# EAGLE design Raspi_Photometer_v2 (EAGLE 7.3.0)
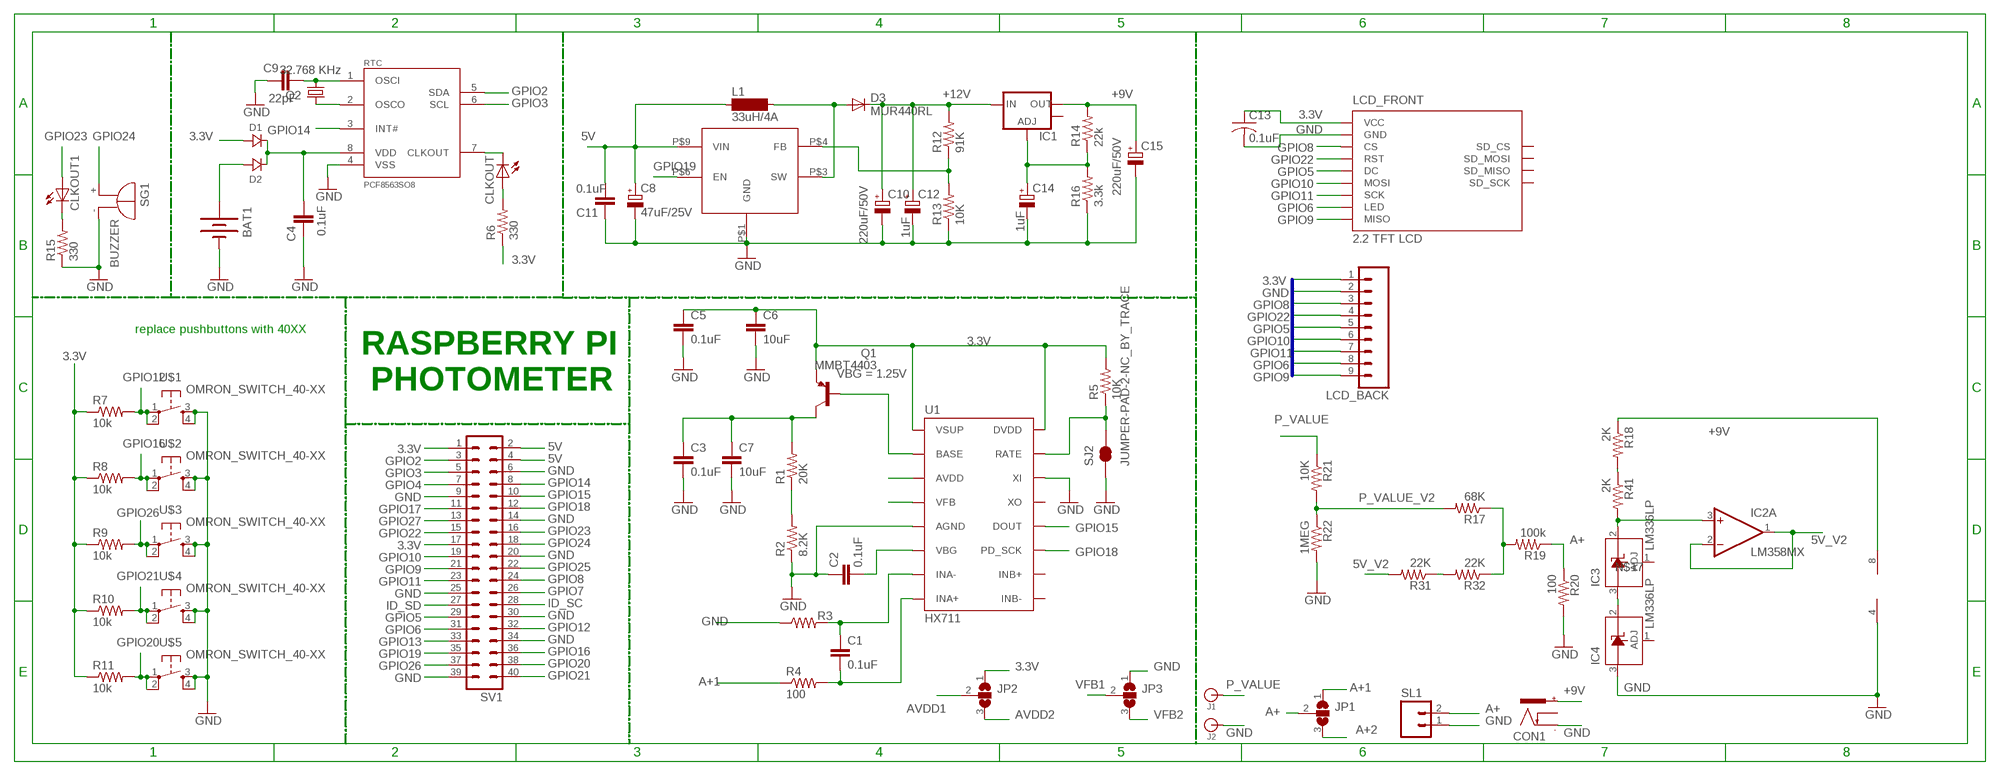
[diagram p0: schematic, sheet 1]

## Parts
BAT1  BATTERY20PTH  [BATTCOM_20MM_PTH]
C1  0.1uF  0.1UF-25V-5%(0603)  [0603-CAP]
C2  0.1uF  0.1UF-25V-5%(0603)  [0603-CAP]
C3  0.1uF  0.1UF-25V-5%(0603)  [0603-CAP]
C4  0.1uF  C-EUC0805K  [C0805K]
C5  0.1uF  0.1UF-25V-5%(0603)  [0603-CAP]
C6  10uF  10UF50V20%(1210)  [1210]
C7  10uF  10UF50V20%(1210)  [1210]
C8  47uF/25V  CPOL-EUE3.5-10  [E3,5-10]
C9  22pF  C-EUC0805K  [C0805K]
C10  220uF/50V  CPOL-EUE5-10.5  [E5-10,5]
C11  0.1uF  C-EUC0603  [C0603]
C12  1uF  CPOL-EUE2.5-5  [E2,5-5]
C13  0.1uF  C-USC0805  [C0805]
C14  1uF  CPOL-EUE2.5-5  [E2,5-5]
C15  220uF/50V  CPOL-EUE5-10.5  [E5-10,5]
CLKOUT  LED0805  [CHIPLED_0805]
CLKOUT1  LED1206  [CHIPLED_1206]
CON1  POWER_CON  [NEB21R]
D1  SS14  [DO214]
D2  SS14  [DO214]
D3  MUR440RL  [C2673]
IC1  V_REG_LM1117SOT223  [SOT223]
IC2  LM358MX  [SO08]
IC3  LM336LP  [TO92]
IC4  LM336LP  [TO92]
J1  BANANA_CONN  [BANANA_CONN]
J2  BANANA_CONN  [BANANA_CONN]
JP1  SJ2W  [SJ_2]
JP2  SJ2W  [SJ_2]
JP3  SJ2W  [SJ_2]
L1  33uH/4A  MS85  [MS85]
LCD_BACK  M09  [09P]
LCD_FRONT  TFT_LCD_2.2  [TFT_LCD_2.2]
Q1  MMBT4403  2N4403-PNP-TO92-EBC  [TO92-EBC]
Q2  32.768 KHz  CRYSTALTC26H  [TC26H]
R1  20K  R-US_0204/7  [0204/7]
R2  8.2K  R-US_0204/7  [0204/7]
R3  100  R-US_0207/15  [0207/15]
R4  100  R-US_0207/7  [0207/7]
R5  10K  R-US_0207/7  [0207/7]
R6  330  R-US_0204/7  [0204/7]
R7  10k  R-US_0204/7  [0204/7]
R8  10k  R-US_0204/7  [0204/7]
R9  10k  R-US_0204/7  [0204/7]
R10  10k  R-US_0204/7  [0204/7]
R11  10k  R-US_0204/7  [0204/7]
R12  91K  RESISTOR0207/7  [0207/7]
R13  10K  RESISTOR0207/7  [0207/7]
R14  22k  RESISTOR0207/7  [0207/7]
R15  330  R-US_0204/7  [0204/7]
R16  3.3k  RESISTOR0207/7  [0207/7]
R17  68K  RESISTOR0207/7  [0207/7]
R18  2K  RESISTOR0207/7  [0207/7]
R19  100k  RESISTOR0207/7  [0207/7]
R20  100  RESISTOR0207/7  [0207/7]
R21  10K  RESISTOR0207/7  [0207/7]
R22  1MEG  RESISTOR0207/7  [0207/7]
R31  22K  RESISTOR0207/7  [0207/7]
R32  22K  RESISTOR0207/7  [0207/7]
R41  2K  RESISTOR0207/7  [0207/7]
RTC  PCF8563SO8  [SOIC8]
SG1  BUZZER  [F/TMB]
SJ2  JUMPER-PAD-2-NC_BY_TRACE  [PAD-JUMPER-2-NC_BY_TRACE_YES_SILK]
SL1  M02  [02P]
SV1  ML40  [ML40]
U1  HX711  HX711HX711  [SO16]
U$1  OMRON_SWITCH_40-XX  [B3F-40XX]
U$2  OMRON_SWITCH_40-XX  [B3F-40XX]
U$3  OMRON_SWITCH_40-XX  [B3F-40XX]
U$4  OMRON_SWITCH_40-XX  [B3F-40XX]
U$5  OMRON_SWITCH_40-XX  [B3F-40XX]
U$6  XL6009  [TO-263-5L]

## Nets
3.3V: C5.1 C6.1 C13.1 D1.ANODE JP2.1 LCD_BACK.1 LCD_FRONT.VCC Q1.E R5.2 R6.1 R7.1 R8.1 R9.1 R10.1 R11.1 SV1.1 SV1.17 U1.1(VSUP) U1.16(DVDD)
5V: C8.+ C11.2 L1.1 SV1.2 SV1.4 U$6.P$9(VIN)
5V_V2: IC2.1(A:OUT) IC2.2(A:-IN) R31.2
+9V: C15.+ CON1.+ IC1.2(OUT) IC2.8(P:V+) R14.2 R18.1
+12V: C10.+ C12.+ D3.C IC1.3(IN) R12.2
A+: JP1.2 R19.1 R20.1 SL1.2
A+1: JP1.1 R4.1
A+2: JP1.3
AVDD1: JP2.2 U1.3(AVDD)
AVDD2: C3.1 C7.1 JP2.3 Q1.C R1.2
GND: BAT1.2(-) C2.1 C3.2 C4.1 C5.2 C6.2 C7.2 C8.- C9.1 C10.- C11.1 C12.- C13.2 C14.- C15.- CON1.- IC2.4(P:V-) IC4.3(A) J2.P$2 JP3.1 LCD_BACK.2 LCD_FRONT.GND R2.1 R3.1 R13.1 R15.1 R16.1 R20.2 R22.2 RTC.4(VSS) SG1.- SJ2.1 SL1.1 SV1.6 SV1.9 SV1.14 SV1.20 SV1.25 SV1.30 SV1.34 SV1.39 U1.5(AGND) U1.14(XI) U$1.3(S) U$1.4(S1) U$2.3(S) U$2.4(S1) U$3.3(S) U$3.4(S1) U$4.3(S) U$4.4(S1) U$5.3(S) U$5.4(S1) U$6.P$1(GND)
GPIO2: RTC.5(SDA) SV1.3
GPIO3: RTC.6(SCL) SV1.5
GPIO4: SV1.7
GPIO5: LCD_BACK.5 LCD_FRONT.DC SV1.29
GPIO6: LCD_BACK.8 LCD_FRONT.LED SV1.31
GPIO7: SV1.26
GPIO8: LCD_BACK.3 LCD_FRONT.CS SV1.24
GPIO9: LCD_BACK.9 LCD_FRONT.MISO SV1.21
GPIO10: LCD_BACK.6 LCD_FRONT.MOSI SV1.19
GPIO11: LCD_BACK.7 LCD_FRONT.SCK SV1.23
GPIO12: R7.2 SV1.32 U$1.1(P) U$1.2(P1)
GPIO13: SV1.33
GPIO14: RTC.3(INT#) SV1.8
GPIO15: SV1.10 U1.12(DOUT)
GPIO16: R8.2 SV1.36 U$2.1(P) U$2.2(P1)
GPIO17: SV1.11
GPIO18: SV1.12 U1.11(PD_SCK)
GPIO19: SV1.35 U$6.P$6(EN)
GPIO20: R11.2 SV1.38 U$5.1(P) U$5.2(P1)
GPIO21: R10.2 SV1.40 U$4.1(P) U$4.2(P1)
GPIO22: LCD_BACK.4 LCD_FRONT.RST SV1.15
GPIO23: CLKOUT1.A SV1.16
GPIO24: SG1.+ SV1.18
GPIO25: SV1.22
GPIO26: R9.2 SV1.37 U$3.1(P) U$3.2(P1)
GPIO27: SV1.13
ID_SC: SV1.28
ID_SD: SV1.27
N$1: R5.1 SJ2.2 U1.15(RATE)
N$2: C1.1 R3.2 U1.7(INA-)
N$3: C1.2 R4.2 U1.8(INA+)
N$4: Q1.B U1.2(BASE)
N$5: BAT1.1(+) D2.ANODE
N$6: R31.1 R32.2
N$7: C2.2 U1.6(VBG)
N$8: C4.2 D1.CATHODE D2.CATHODE RTC.8(VDD)
N$9: CLKOUT.C RTC.7(CLKOUT)
N$10: CLKOUT.A R6.2
N$11: C9.2 Q2.1 RTC.1(OSCI)
N$12: Q2.2 RTC.2(OSCO)
N$14: D3.A L1.2 U$6.P$3(SW)
N$16: R12.1 R13.2 U$6.P$4(FB)
N$17: IC2.3(A:+IN) IC3.2(C) R41.2
N$18: C14.+ IC1.1(ADJ) R14.1 R16.2
N$19: CLKOUT1.C R15.2
N$20: R17.1 R19.2 R32.1
N$21: R18.2 R41.1
N$22: IC3.3(A) IC4.2(C)
P_VALUE: J1.P$2 R21.1
P_VALUE_V2: R17.2 R21.2 R22.1
VFB1: JP3.2 U1.4(VFB)
VFB2: JP3.3 R1.1 R2.2
Unconnected: CON1.C IC1.4(OUT) IC2.5(B:+IN) IC2.6(B:-IN) IC2.7(B:OUT) IC3.1(ADJ) IC4.1(ADJ) LCD_FRONT.SD_CS LCD_FRONT.SD_MISO LCD_FRONT.SD_MOSI LCD_FRONT.SD_SCK U1.9(INB-) U1.10(INB+) U1.13(XO)

## Buses
3.3V,GND,GPIO8,GPIO22,GPIO5,GPIO10,GPIO11,GPIO6,GPIO9

## Notes on the sheet
- replace pushbuttons with 40XX
- VBG = 1.25V
- RASPBERRY PI 
   PHOTOMETER

## Library data of the parts
BAT1 = SparkFun-Electromechanical:BATTERY: Battery Holders Various common sizes : AA, AAA, 20mm coin cell and 12mm coin cell. 20MM_4LEGS, BATT-10373
C1-C3 C5 = SparkFun-Capacitors:0.1UF-25V-5%(0603): CAP-08604; PROD_ID: CAP-08604
C4 C9 C11 = rcl:C-EU: CAPACITOR, European symbol
C6 C7 = SparkFun-Capacitors:10UF50V20%(1210): CAP-09824; PROD_ID: CAP-09824
C8 C10 C15 = rcl:CPOL-EU: POLARIZED CAPACITOR, European symbol
C12 C14 = rcl (2):CPOL-EU: POLARIZED CAPACITOR, European symbol
C13 = rcl:C-US: CAPACITOR, American symbol
CLKOUT CLKOUT1 = CEDT_2016_V1:LED
CON1 = CEDT_July_2014:POWER_CON: DC Power Connector
D1 D2 = ihpcb-diode:SS14
D3 = diode:MUR440RL: DIODE ultra-fast recovery rectifier, Vrrm = 40 V, 4 A
IC1 = SparkFun-PowerIC:V_REG_LM1117: Voltage Regulator LM1117 Standard adjustable voltage regulator but in SMD form. Spark Fun Electronics SKU : COM-00595; PROD_ID: VREG-08170
IC2 = CEDT_July_2014:LM358: OP AMP also LM158; LM258; LM2904 Source: http://cache.national.com/ds/LM/LM158.pdf
IC3 IC4 = linear:LM336: 2.5-V INTEGRATED REFERENCE CIRCUITS LM236 Source: http://focus.ti.com/lit/ds/symlink/lm336-2.5.pdf
J1 J2 = SparkFun-Connectors:BANANA_CONN: Through-hole banana jack
JP1-JP3 = jumper:SJ2W: SMD solder JUMPER
L1 = inductor-neosid:MS85: INDUCTOR SMD power inductor; OC_FARNELL: unknown; OC_NEWARK: unknown
LCD_BACK = con-amp-quick:M09: AMP QUICK CONNECTOR; OC_FARNELL: unknown; OC_NEWARK: unknown
LCD_FRONT = CEDT_JANUARY_2015_v4:TFT_LCD_2.2
Q1 = transistor-neu-to92:*-PNP-: PNP Transistror
Q2 = CEDT_JANUARY_2015_v5:CRYSTAL: Crystals Various standard crystals. Proven footprints. Spark Fun Electronics SKU : COM-00534
R1-R11 R15 = rcl:R-US_: RESISTOR, American symbol
R12-R14 R16-R22 R31 R32 R41 = CEDTv83 (2):RESISTOR
RTC = CEDT_SEPTEMBER_V2:PCF8563
SG1 = CEDT_JANUARY_2015_v5:BUZZER: BUZZER Source: Buerklin; OC_FARNELL: unknown; OC_NEWARK: unknown
SJ2 = SparkFun-Passives:JUMPER-PAD-2-NC_BY_TRACE
SL1 = CEDT_JANUARY_2015_v5:M02: AMP QUICK CONNECTOR
SV1 = con-ml:ML40: HARTING; OC_FARNELL: unknown; OC_NEWARK: unknown
U1 = Testing:HX711; PROD_ID: IC-12445
U$1-U$5 = CEDT_JANUARY_2015_v5:OMRON_SWITCH
U$6 = XL6009:XL6009

## Net classes
1 pwr: width 0.457 mm

## Board
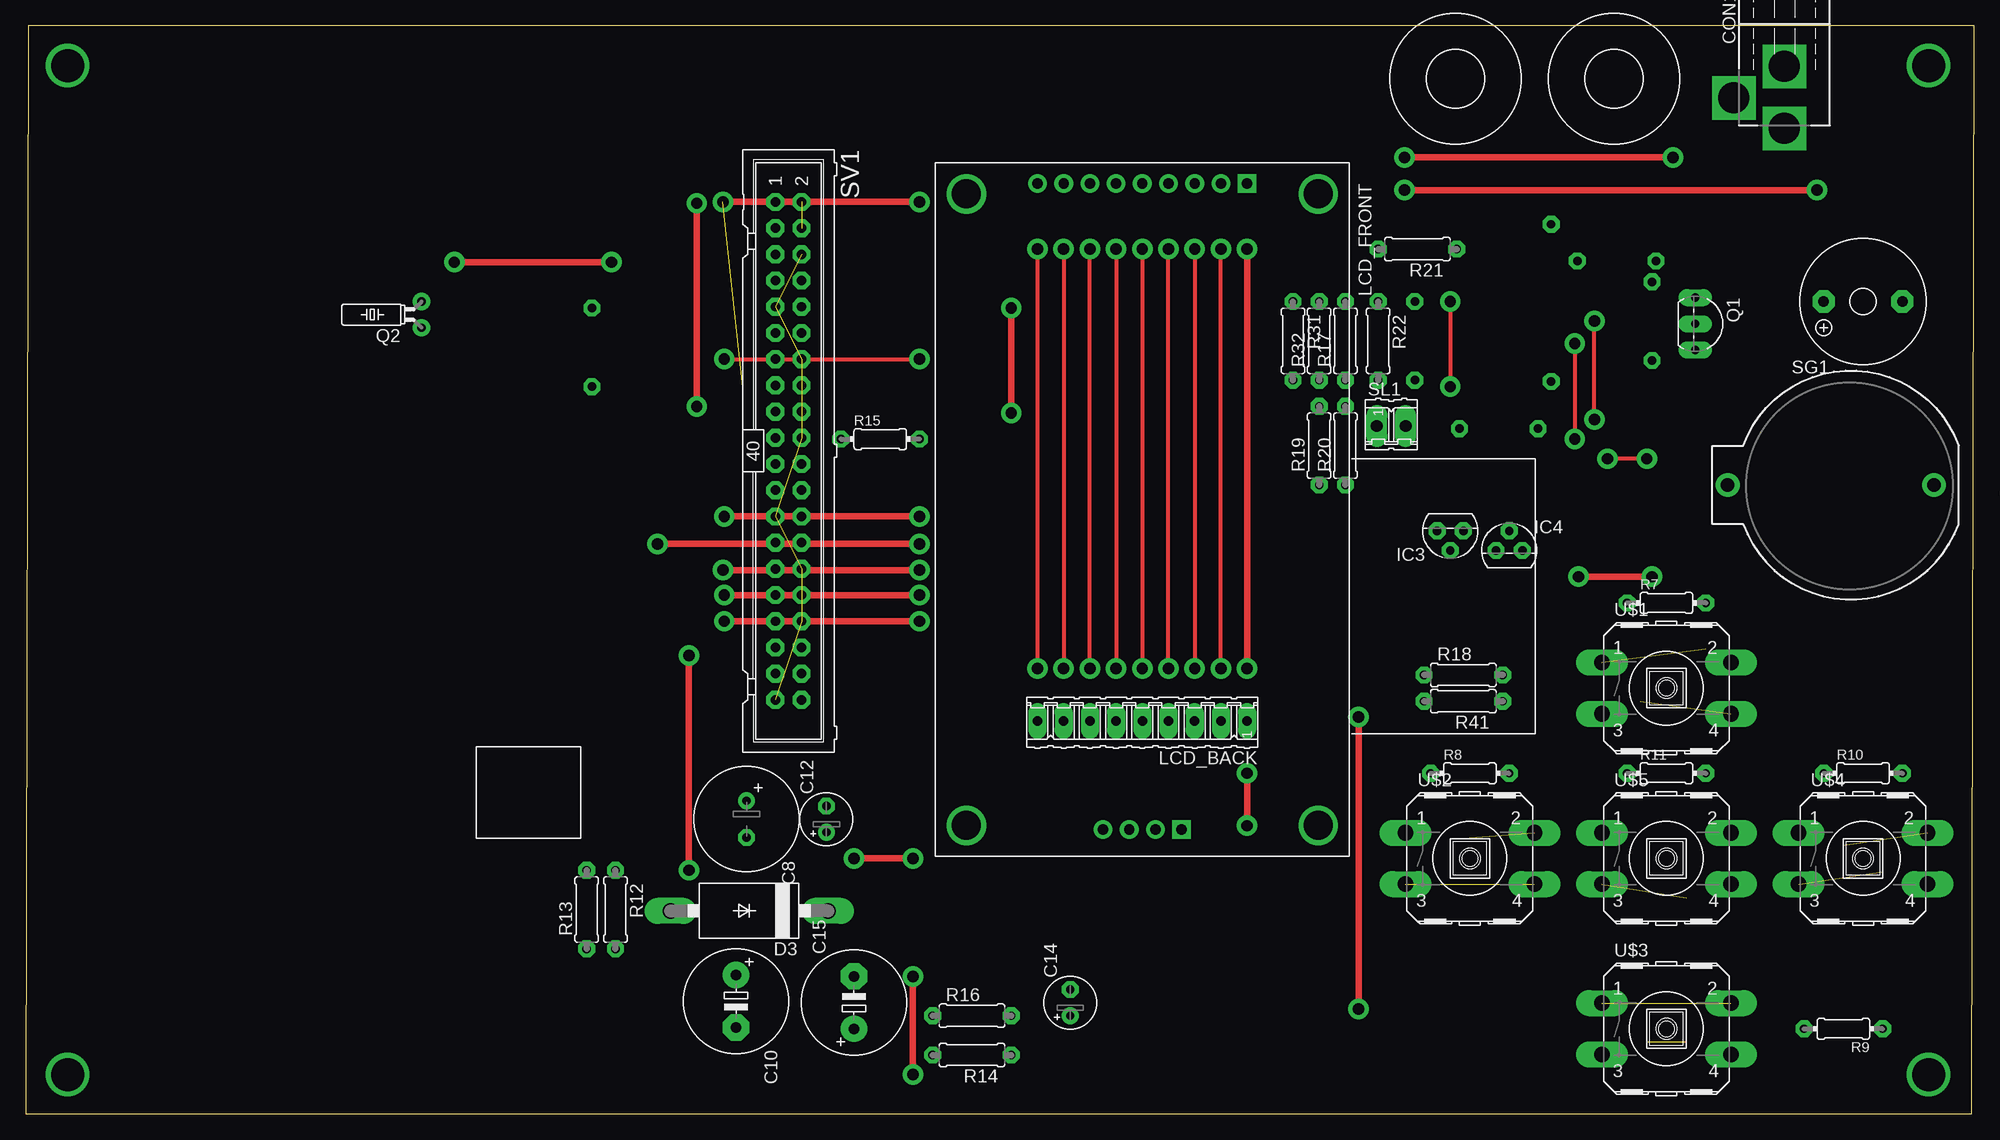
[diagram p1: board, top side]
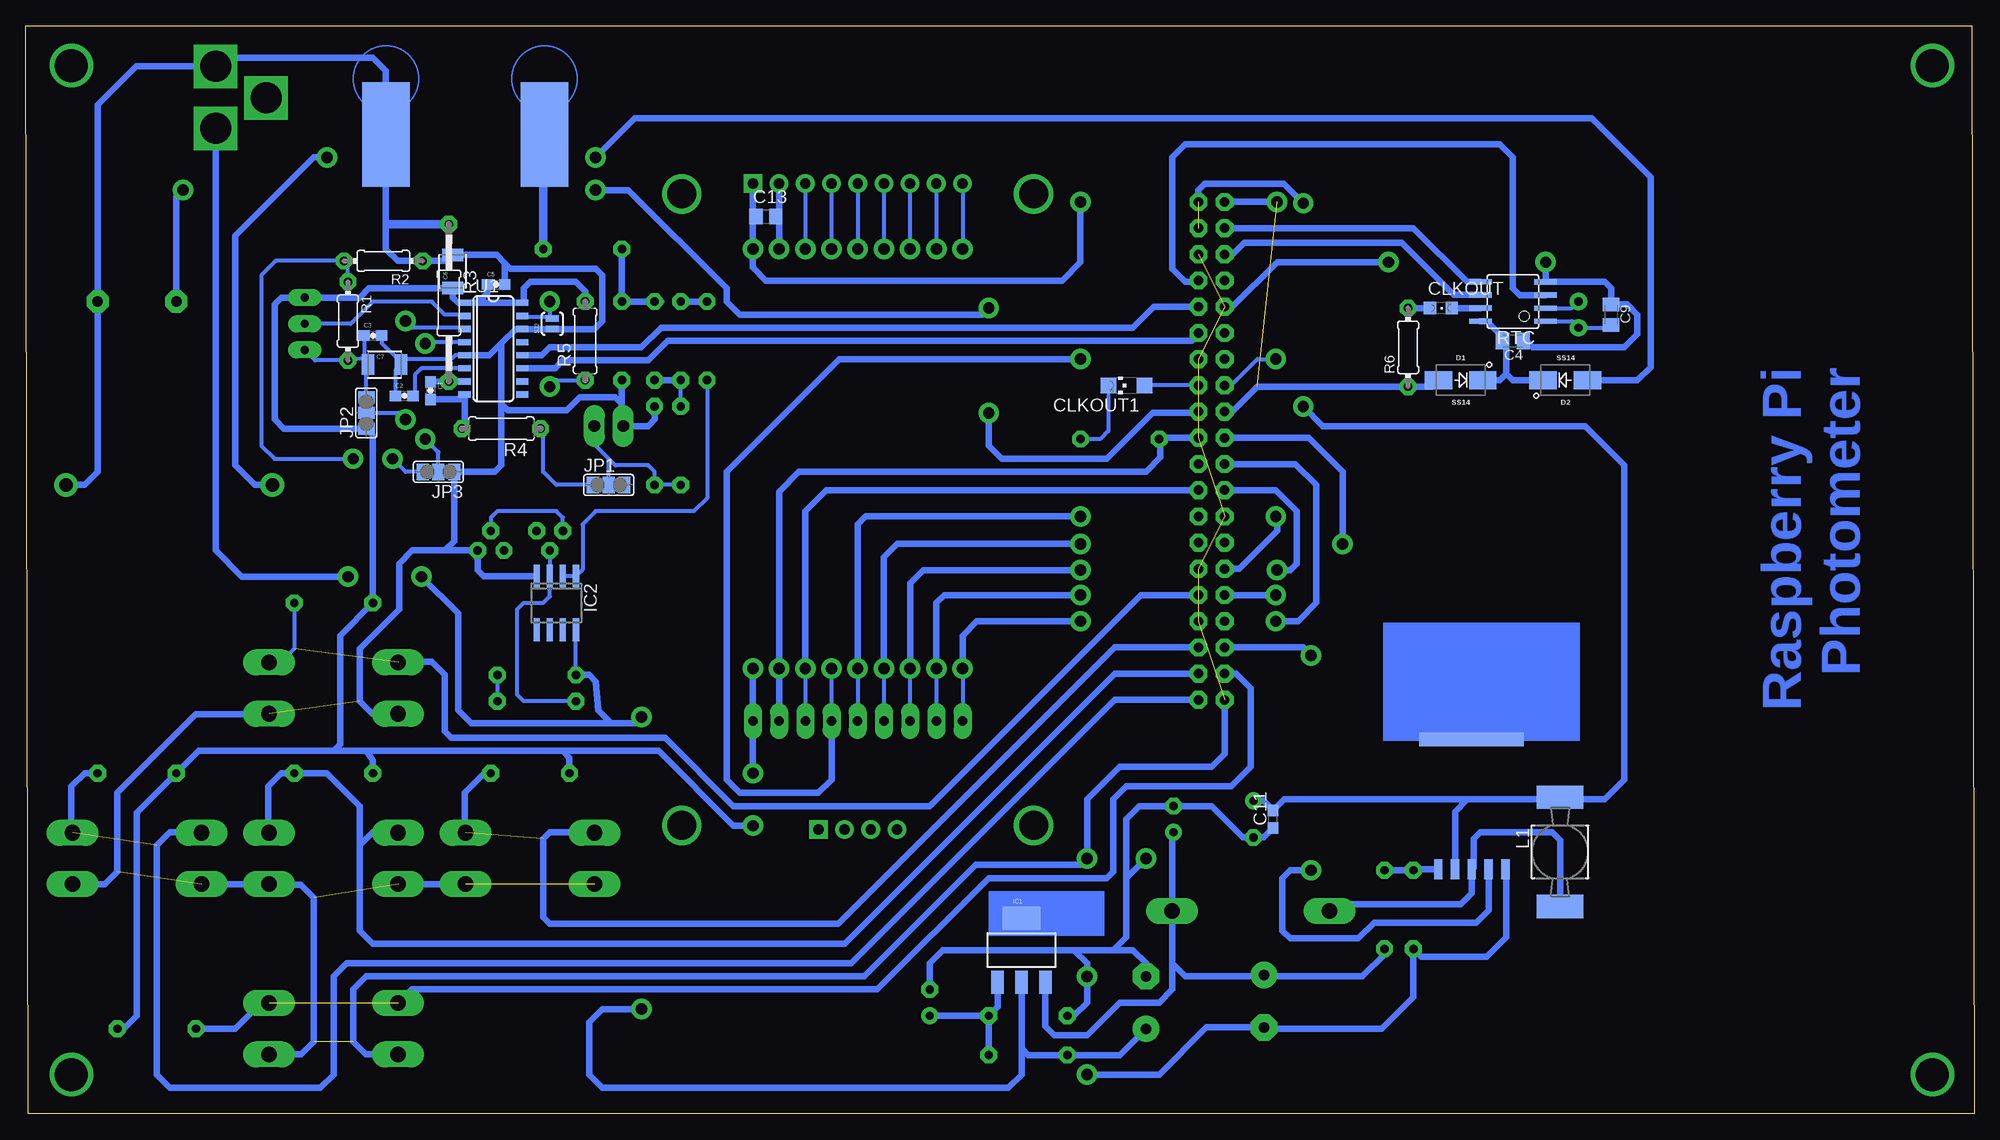
[diagram p2: board, bottom side, seen from below]

Size 188.83 x 105.46 mm. Coordinates in mm from the lower left corner, seen from the top.
Outline: 0,0 188.57,0 188.83,105.46 0.25,105.46 0,0
Copper layers (1*16): Top 0.035mm / dielectric 1.5mm / Bottom 0.035mm
Design rules "default *": minimum track width 10mil, minimum drill 24mil, track to track 16mil, track to pad 16mil, pad to pad 16mil, via to via 16mil, smd to smd 16mil, copper to edge 40mil, drill to drill 8mil, minimum pad ring 16mil, minimum via ring 16mil, stop-mask expansion 4mil, vias tented up to drill 0mil, thermal gap 10mil

### Footprints (pad centres in the part's own frame; a part is rotated, then mirrored left to right if it is on the bottom)
BATTCOM_20MM_PTH = drill 1.3: 1 11.85,0; 2 -8.15,0
0603-CAP = smd 1.1 x 1: 1 -0.85,0; 2 0.85,0
C0805K = smd 1.3 x 1.6: 1 -1,0; 2 1,0
1210 = smd 1.2 x 2: 1 -1.6,0; 2 1.6,0
E3,5-10 = drill 0.813 pad 1.6: + -1.778,0 | drill 0.813 pad 1.6 octagon: - 1.778,0
E5-10,5 = drill 1.016 pad 2.54: + -2.54,0 | drill 1.016 pad 2.54 octagon: - 2.54,0
C0603 = smd 1.1 x 1: 1 -0.85,0; 2 0.85,0
E2,5-5 = drill 0.813 pad 1.6: + -1.27,0 | drill 0.813 pad 1.6 octagon: - 1.27,0
C0805 = smd 1.3 x 1.5: 1 -0.95,0; 2 0.95,0
CHIPLED_0805 = smd 1.2 x 1.2: A 0,-1.05; C 0,1.05
CHIPLED_1206 = smd 1.5 x 1.5: A 0,-1.75; C 0,1.75
NEB21R = drill 3 pad 4.2 square: + 0,3.54; - 0,-2.46; C 4.9,0.59
DO214 = smd 2.65 x 1.75: ANODE -2.15,0; CATHODE 2.15,0
C2673 = drill 1.499 long: A 7.62,0; C -7.62,0
SOT223 = smd 1.219 x 2.235: 1 -2.311,-3.099; 2 0,-3.099; 3 2.311,-3.099 | smd 3.6 x 2.2: 4 0,3.099
SO08 = smd 0.6 x 2.2: 1 -1.905,-2.6; 2 -0.635,-2.6; 3 0.635,-2.6; 4 1.905,-2.6; 5 1.905,2.6; 6 0.635,2.6; 7 -0.635,2.6; 8 -1.905,2.6
TO92 = drill 0.813 octagon: 1 -1.27,0; 2 0,1.905; 3 1.27,0
BANANA_CONN = smd 10.16 x 4.572 bottom: P$2 5.397,0
SJ_2 = smd 1.168 x 1.6: 1 -1.524,0; 2 0,0; 3 1.524,0
MS85 = smd 4.5 x 2.25: 1 0,-5.288; 2 0,5.288
09P = drill 0.914 long: 1 -10.16,0; 2 -7.62,0; 3 -5.08,0; 4 -2.54,0; 5 0,0; 6 2.54,0; 7 5.08,0; 8 7.62,0; 9 10.16,0
TFT_LCD_2.2 = drill 1: CS 0,-5.08; DC 0,-10.16; GND 0,-2.54; LED 0,-17.78; MISO 0,-20.32; MOSI 0,-12.7; RST 0,-7.62; SCK 0,-15.24; SD_MISO 62.611,-11.43; SD_MOSI 62.611,-8.89; SD_SCK 62.611,-13.97 | drill 2.8: P$1 1,6.89; P$2 62.2,6.89; P$3 62.2,-27.21; P$4 1,-27.21 | drill 1 square: SD_CS 62.611,-6.35; VCC 0,0
TO92-EBC = drill 0.813 long: B 0,-1.27; C 2.54,-1.27; E -2.54,-1.27
TC26H = drill 0.813 pad 1.676: 1 -1.27,0; 2 1.27,0
0204/7 = drill 0.813 octagon: 1 -3.81,0; 2 3.81,0
0207/15 = drill 0.813 octagon: 1 -7.62,0; 2 7.62,0
0207/7 = drill 0.813 octagon: 1 -3.81,0; 2 3.81,0
SOIC8 = smd 0.5 x 2.2: 1 -1.905,-3.154; 2 -0.645,-3.154; 3 0.625,-3.154; 4 1.895,-3.154; 5 1.905,3.154; 6 0.635,3.154; 7 -0.635,3.154; 8 -1.905,3.154
F/TMB = drill 1.016 pad 2.159 octagon: + 3.81,0; - -3.81,0
PAD-JUMPER-2-NC_BY_TRACE_YES_SILK = smd 0.635 x 1.27: 1 -0.508,0; 2 0.508,0
02P = drill 1.143 long: 1 -1.397,0; 2 1.397,0
ML40 = drill 0.914 octagon: 1 -24.13,-1.27; 2 -24.13,1.27; 3 -21.59,-1.27; 4 -21.59,1.27; 5 -19.05,-1.27; 6 -19.05,1.27; 7 -16.51,-1.27; 8 -16.51,1.27; 9 -13.97,-1.27; 10 -13.97,1.27; 11 -11.43,-1.27; 12 -11.43,1.27; 13 -8.89,-1.27; 14 -8.89,1.27; 15 -6.35,-1.27; 16 -6.35,1.27; 17 -3.81,-1.27; 18 -3.81,1.27; 19 -1.27,-1.27; 20 -1.27,1.27; 21 1.27,-1.27; 22 1.27,1.27; 23 3.81,-1.27; 24 3.81,1.27; 25 6.35,-1.27; 26 6.35,1.27; 27 8.89,-1.27; 28 8.89,1.27; 29 11.43,-1.27; 30 11.43,1.27; 31 13.97,-1.27; 32 13.97,1.27; 33 16.51,-1.27; 34 16.51,1.27; 35 19.05,-1.27; 36 19.05,1.27; 37 21.59,-1.27; 38 21.59,1.27; 39 24.13,-1.27; 40 24.13,1.27
SO16 = smd 0.6 x 1.2: 1 -4.445,-2.8; 2 -3.175,-2.8; 3 -1.905,-2.8; 4 -0.635,-2.8; 5 0.635,-2.8; 6 1.905,-2.8; 7 3.175,-2.8; 8 4.445,-2.8; 9 4.445,2.8; 10 3.175,2.8; 11 1.905,2.8; 12 0.635,2.8; 13 -0.635,2.8; 14 -1.905,2.8; 15 -3.175,2.8; 16 -4.445,2.8
B3F-40XX = drill 1.524 long: 1 -6.248,2.489; 2 6.248,2.489; 3 -6.248,-2.489; 4 6.248,-2.489
TO-263-5L = smd 0.813 x 1.93 bottom: P$1 -0.406,0.838; P$3 2.845,0.838; P$4 6.096,0.838; P$6 1.219,0.838; P$9 4.47,0.838 | smd 10.16 x 1.27 bottom: P$5 2.87,13.437

### Placement (x,y rotation side)
BAT1  176.78,60.96 180 top
C1  149.61,70.1 270 bottom
C2  152.15,69.6 0 bottom
C3  155.19,75.44 0 bottom
C4  44.7,74.93 180 bottom
C5  143.26,80.39 0 bottom
C6  147.45,81.66 90 bottom
C7  154.05,72.64 0 bottom
C8  69.85,28.57 270 top
C9  35.18,77.47 270 bottom
C10  68.83,10.92 270 top
C11  67.94,28.57 90 bottom
C12  77.6,28.57 90 top
C13  117.09,87 0 bottom
C14  101.22,10.79 90 top
C15  80.26,10.79 90 top
CLKOUT  51.69,78.11 270 bottom
CLKOUT1  82.17,70.61 90 bottom
CON1  170.43,99.06 180 top
D1  49.78,71.12 0 bottom
D2  39.62,71.12 180 bottom
D3  70.1,19.68 180 top
IC1  92.33,15.88 0 bottom
IC2  137.41,49.53 180 bottom
IC3  138.05,56.52 180 top
IC4  143.76,54.61 0 top
J1  138.56,100.33 270 top
J2  153.92,100.33 270 top
JP1  132.33,60.96 0 bottom
JP2  155.83,67.94 90 bottom
JP3  148.84,62.23 180 bottom
L1  40.13,25.4 180 bottom
LCD_BACK  108.2,38.1 180 top
LCD_FRONT  118.36,90.17 270 top
Q1  163.07,76.58 270 top
Q2  38.35,77.47 90 top
R1  157.61,76.83 270 bottom
R2  154.18,82.68 180 bottom
R3  147.83,78.61 270 bottom
R4  142.75,66.42 180 bottom
R5  134.62,74.93 90 bottom
R6  54.86,74.3 90 bottom
R7  159,49.53 0 top
R8  139.95,33.02 0 top
R9  176.15,8.26 180 top
R10  178.05,33.02 0 top
R11  159,33.02 0 top
R12  57.15,19.81 270 top
R13  54.36,19.81 90 top
R14  91.69,5.71 180 top
R15  82.8,65.41 0 top
R16  91.69,9.53 0 top
R17  127.89,74.93 90 top
R18  139.32,42.55 0 top
R19  125.35,64.77 90 top
R20  127.89,64.77 90 top
R21  134.87,83.82 180 top
R22  131.06,74.93 270 top
R31  122.81,74.93 270 top
R32  125.35,74.93 90 top
R41  139.32,40.01 180 top
RTC  44.7,78.74 90 bottom
SG1  178.05,78.74 180 top
SJ2  137.79,76.58 90 bottom
SL1  132.33,66.67 0 top
SV1  73.91,64.26 270 top
U1  143.51,74.17 270 bottom
U$1  159,41.27 0 top
U$2  139.95,24.77 0 top
U$3  159,8.26 0 top
U$4  178.05,24.77 0 top
U$5  159,24.77 0 top
U$6  45.85,22.86 0 top

### Tracks (layer width: path | path; a pad name or v marks a point on that pad's centre or on a via)
3.3V  (via drill 1.1 pad 1.93)  (1 unrouted)
  Top 0.61: v118.36,43.18 v118.36,83.82 | v118.36,33.02 v118.36,27.94 | v67.56,88.39 v86.61,88.39
  Bottom 0.406: C13.1 118.04,87.31 118.36,87.63 | 147.5,80.01 C6.1 | 140.59,78.73 U1.16 | 52.57,70.48 D1.ANODE | 72.01,67.94 72.52,67.94 SV1.17
  Bottom 0.61: LCD_FRONT.VCC 118.36,87.63 v118.36,83.82 118.36,82.04 117.09,80.77 88.39,80.77 86.61,82.55 v86.61,88.39 | U1.16 145.03,78.61 | 145.03,78.61 U1.1 146.94,78.61 147.45,79.12 C6.1 | C5.1 144.11,79.54 145.03,78.61 | R8.1 136.14,34.54 136.78,35.18 | 136.78,35.18 155.83,35.18 | 155.83,35.18 159,35.18 | 159,35.18 172.09,35.18 R10.1 178.05,29.21 178.05,9.53 179.32,8.26 R9.1 | R11.1 155.19,34.29 155.83,35.18 | 159,35.18 158.37,35.81 158.37,46.35 R7.1 155.19,65.79 JP2.1 163.83,66.42 164.72,67.31 164.72,78.49 164.08,79.12 Q1.E 156.46,79.12 155.57,80.01 147.5,80.01 | R5.2 134.62,79.76 135.51,80.64 139.95,80.64 140.59,80.01 140.59,78.73 | 52.57,70.48 R6.1 69.47,70.48 72.01,67.94 | v118.36,33.02 LCD_BACK.1 v118.36,43.18 | v118.36,27.94 120.27,27.94 127.51,35.18 136.78,35.18 | SV1.1 v67.56,88.39
5V  (via drill 1.1 pad 1.93)  (1 unrouted)
  Top 0.61: v65.02,88.27 v65.02,68.58
  Bottom 0.61: 49.15,30.48 40.34,30.48 L1.1 39.92,30.48 35.81,30.48 33.91,32.38 33.91,62.87 37.72,66.67 63.12,66.67 v65.02,68.58 | U$6.P$9 50.32,29.31 49.15,30.48 | 49.15,30.48 66.89,30.48 C11.2 68.87,30.35 C8.+ | SV1.2 75.18,89.53 74.55,90.17 66.93,90.17 v65.02,88.27
5V_V2
  Bottom 0.406: IC2.1 IC2.2 | 135.45,52.07 IC2.1 | R31.2 122.81,59.69 124.08,58.42 133.6,58.42 134.87,57.15 134.87,52.77 IC2.1
+9V  (via drill 1.1 pad 1.93)
  Top 0.61: v129.16,10.16 v129.16,38.48 | v157.61,52.07 v150.5,52.07
  Bottom 0.406: R18.1 IC2.8
  Bottom 0.61: 92.33,6.35 91.69,5.71 R14.2 82.8,5.71 C15.+ | 92.33,6.35 IC1.2 | 92.33,6.35 92.33,3.81 93.6,2.54 132.97,2.54 134.24,3.81 134.24,8.89 132.97,10.16 v129.16,10.16 | CON1.+ 170.43,54.61 167.89,52.07 v157.61,52.07 | v150.5,52.07 146.94,48.51 146.94,39.12 145.67,37.85 132.08,37.85 | 132.08,37.85 129.79,37.85 v129.16,38.48 | R18.1 134.24,42.55 133.6,41.91 133.35,39.12 132.08,37.85
+12V
  Bottom 0.61: R12.2 57.15,15.49 59.31,13.34 68.71,13.34 C10.+ 68.96,13.34 76.45,13.34 77.72,14.61 | 77.72,14.61 D3.C 77.72,26.67 C12.+ | IC1.3 90.02,8.48 89.15,7.62 85.98,7.62 82.8,10.79 78.99,10.79 77.72,12.06 77.72,14.61
A+
  Bottom 0.406: JP1.2 132.33,63.5 | R19.1 R20.1 127.89,62.23 128.52,62.87 131.7,62.87 132.33,63.5 | 132.33,63.5 133.6,64.77 133.6,66.55 SL1.2
A+1
  Bottom 0.406: JP1.1 137.41,60.96 138.68,62.23 138.68,66.8 R4.1
AVDD1  (via drill 1.1 pad 1.93)
  Top 0.406: v152.02,67.31 v152.02,76.83
  Bottom 0.406: JP2.2 152.65,67.94 v152.02,67.31 | U1.3 146.44,76.2 151.38,76.2 v152.02,76.83
AVDD2
  Bottom 0.406: Q1.C 160.78,73.03 R1.2 156.08,73.28 155.65,72.85 C7.1 | JP2.3 155.83,72.47 C7.1 | C3.1 156.04,73.04 C7.1
GND  (via drill 1.1 pad 1.93)  (12 unrouted)
  Top 0.406: v115.82,43.18 v115.82,83.82
  Top 0.61: v85.98,3.81 v85.98,13.34 | v85.98,24.77 v80.26,24.77 | v56.77,82.55 v41.53,82.55
  Bottom 0.406: C13.2 116.14,87.31 115.82,87.63 | 142.15,80.64 C5.2 | U1.14 141.35,76.07 | 131.06,66.8 SL1.1 | U1.5 147.19,73.53 147.57,73.15 151.94,73.15 C7.2 | C2.1 153,72.1 C7.2 | 153.8,86.23 153.92,86.36 | C3.2 154.34,74.72 152.65,73.03 152.65,72.85 C7.2
  Bottom 0.61: LCD_BACK.2 v115.82,43.18 115.82,60.33 113.92,62.23 80.26,62.23 78.87,63.63 78.87,65.53 | v115.82,83.82 115.82,87.63 LCD_FRONT.GND | U$6.P$1 45.34,23.6 45.34,17.14 47.24,15.24 53.59,15.24 R13.1 54.36,11.3 57.4,8.26 68.71,8.26 C10.- 74.42,8.38 78.99,3.81 v85.98,3.81 | C11.1 68.87,26.8 C8.- 70.87,26.8 73.91,29.84 C12.- 80.9,29.84 82.17,28.57 82.17,22.86 | C14.- 101.22,14.61 99.95,15.88 87.25,15.88 | 87.25,15.88 83.44,15.88 | C15.- 80.26,14.61 81.53,15.88 83.44,15.88 | 82.17,22.86 82.17,17.14 83.44,15.88 | C5.2 142.41,82.46 | 142.41,82.46 143.21,83.26 C6.2 148.03,82.68 R2.1 152.78,82.68 153.92,83.82 153.92,86.36 J2.P$2 153.92,101.09 155.19,102.36 169.59,102.36 CON1.- 178.13,101.52 181.86,97.79 SG1.- 181.86,62.23 183.13,60.96 BAT1.2 | 87.25,15.88 85.98,14.61 v85.98,13.34 85.98,10.79 87.25,9.53 R16.1 | SV1.39 72.64,34.92 73.91,33.66 82.8,33.66 85.98,30.48 v85.98,24.77 86.61,24.13 96.77,24.13 107.57,13.34 155.83,13.34 157.1,12.06 157.1,6.99 155.88,5.77 U$3.3 | U$4.3 U$5.4 165.2,22.23 162.18,22.23 160.91,20.95 160.91,6.99 162.13,5.77 U$3.4 | U$5.3 U$2.4 | U$4.4 181.18,22.28 179.96,23.5 179.96,31.11 172.34,38.73 165.3,38.73 U$1.4 | 141.35,76.07 142.75,74.68 | 142.75,74.68 143.89,73.53 U1.5 | 142.41,82.46 141.86,81.92 133.6,81.92 132.97,81.28 132.97,76.83 133.73,76.07 SJ2.1 U1.14 | U$1.3 155.25,38.79 156.46,40.01 156.46,45.09 152.65,48.9 152.65,53.34 151.38,54.61 148.21,54.61 | 148.21,54.61 IC4.3 145.03,52.7 144.46,52.13 IC2.4 | 148.21,54.61 147.32,55.5 JP3.1 143.38,62.23 142.75,62.87 142.75,68.83 | R20.2 127.89,67.31 128.52,66.67 SL1.1 | 131.06,66.8 131.06,68.83
  Bottom 0.61: 131.06,68.83 131.7,69.47 135.13,69.47 136.4,68.2 142.11,68.2 142.75,68.83 | 142.75,68.83 142.75,74.68 | R22.2 131.06,68.83 | v80.26,24.77 82.17,22.86 | C4.1 43.43,74.93 42.8,74.3 33.91,74.3 32.64,75.56 32.64,77.47 33.64,78.47 C9.1 35.18,80.01 35.8,80.64 RTC.4 41.53,80.66 v41.53,82.55 | SV1.9 71.88,78.23 67.56,82.55 v56.77,82.55 | SV1.20 78.87,65.53 | 78.87,65.53 R15.1
  Bottom 0.813: R3.1 153.8,86.23
GPIO2
  Bottom 0.61: SV1.3 54.36,85.85 49.15,80.64 RTC.5
GPIO3
  Bottom 0.61: RTC.6 50.42,79.38 55.5,84.45 70.74,84.45 72.01,83.19 72.52,83.19 SV1.5
GPIO5  (via drill 1.1 pad 1.93)
  Top 0.406: v108.2,83.82 v108.2,43.18
  Top 0.61: v67.69,57.91 v86.61,57.91
  Bottom 0.406: LCD_FRONT.DC v108.2,83.82 | v108.2,43.18 LCD_BACK.5
  Bottom 0.61: v86.61,57.91 107.44,57.91 108.2,57.15 v108.2,43.18 | SV1.29 71.25,52.83 67.56,56.52 67.56,57.78 v67.69,57.91
GPIO6  (via drill 1.1 pad 1.93)
  Top 0.406: v100.58,83.82 v100.58,43.18
  Top 0.61: v67.69,50.29 v86.61,50.29
  Bottom 0.406: LCD_FRONT.LED v100.58,83.82 | v100.58,43.18 LCD_BACK.8
  Bottom 0.61: SV1.31 v67.69,50.29 | v86.61,50.29 99.82,50.29 100.58,49.53 v100.58,43.18
GPIO8  (via drill 1.1 pad 1.93)
  Top 0.406: v113.28,83.82 v113.28,43.18
  Bottom 0.406: LCD_FRONT.CS v113.28,83.82 | v113.28,43.18 LCD_BACK.3
  Bottom 0.61: SV1.24 111.25,60.45 113.28,58.42 v113.28,43.18
GPIO9  (via drill 1.1 pad 1.93)
  Top 0.406: v98.04,83.82 v98.04,43.18
  Top 0.61: v67.69,47.75 v86.61,47.75
  Bottom 0.406: LCD_FRONT.MISO v98.04,83.82 | v98.04,43.18 LCD_BACK.9
  Bottom 0.61: v67.69,47.75 65.53,47.75 63.75,49.53 63.75,60.96 65.79,62.99 SV1.21 | v86.61,47.75 96.65,47.75 98.04,46.35 v98.04,43.18
GPIO10  (via drill 1.1 pad 1.93)
  Top 0.406: v105.66,83.82 v105.66,43.18
  Top 0.61: v61.21,55.24 v86.61,55.24
  Bottom 0.406: LCD_FRONT.MOSI v105.66,83.82 | v105.66,43.18 LCD_BACK.6
  Bottom 0.61: SV1.19 64.52,65.53 61.21,62.23 v61.21,55.24 | v86.61,55.24 104.39,55.24 105.66,53.98 v105.66,43.18
GPIO11  (via drill 1.1 pad 1.93)
  Top 0.406: v103.12,43.18 v103.12,83.82
  Top 0.61: v67.56,52.7 v86.61,52.7
  Bottom 0.406: v103.12,83.82 LCD_FRONT.SCK | LCD_BACK.7 v103.12,43.18
  Bottom 0.61: SV1.23 67.69,60.45 65.66,58.42 65.66,53.34 66.29,52.7 v67.56,52.7 | v86.61,52.7 101.85,52.7 103.12,51.44 v103.12,43.18
GPIO12  (1 unrouted)
  Bottom 0.406: R7.2 162.81,45.09 164.08,43.81 165.2,43.81 U$1.2
  Bottom 0.61: U$1.1 152.71,43.81 149.48,43.81 148.21,42.55 148.21,37.08 147.57,36.45 126.87,36.45 120.27,29.84 101.22,29.84 80.77,50.29 SV1.32
GPIO14
  Bottom 0.61: RTC.3 44.06,79.36 44.7,80.01 44.7,92.71 45.97,93.98 76.45,93.98 77.72,92.71 77.72,81.92 76.45,80.64 75.31,80.64 SV1.8
GPIO15
  Bottom 0.61: U1.12 138.81,73.53 138.05,74.3 129.16,74.3 127.25,76.2 81.53,76.2 79.5,78.23 SV1.10
GPIO16  (1 unrouted)
  Bottom 0.61: U$2.1 133.76,27.3 138.05,27.3 138.68,26.67 138.68,19.05 138.05,18.41 110.11,18.41 83.31,45.21 SV1.36 | R8.2 144.4,33.02 146.3,31.11 146.3,27.36 U$2.2
GPIO18
  Bottom 0.61: SV1.12 75.18,75.56 75.82,74.93 126.62,74.93 128.52,73.03 136.78,73.03 137.54,72.26 U1.11
GPIO19  (via drill 1.1 pad 1.93)
  Top 0.61: v64.26,44.45 v64.26,23.62
  Bottom 0.61: U$6.P$6 47.07,19.74 48.26,18.54 58.17,18.54 59.69,17.02 66.29,17.02 67.06,17.78 67.06,22.86 66.29,23.62 v64.26,23.62 | SV1.35 65.02,45.21 v64.26,44.45
GPIO20
  Bottom 0.61: 156.46,26.04 156.46,17.78 155.19,16.51 109.47,16.51 83.31,42.67 SV1.38 | 156.46,26.04 155.19,27.3 152.81,27.3 U$5.1 | 156.46,26.04 156.46,29.84 159.64,33.02 R11.2 164.08,33.02 165.35,31.75 165.35,27.36 U$5.2
GPIO21  (1 unrouted)
  Bottom 0.61: U$4.1 171.86,27.3 174.88,27.3 176.15,26.04 176.15,3.81 174.88,2.54 160.27,2.54 159,3.81 159,13.34 157.73,14.61 108.84,14.61 83.31,40.13 SV1.40 | R10.2 183.13,33.02 184.4,31.75 184.4,27.36 U$4.2
GPIO22  (via drill 1.1 pad 1.93)
  Top 0.406: v110.74,43.18 v110.74,83.82 | v67.69,73.15 v86.61,73.15
  Bottom 0.406: LCD_BACK.4 v110.74,43.18 | v110.74,83.82 LCD_FRONT.RST | SV1.15 72.01,70.61 69.47,73.15 v67.69,73.15
  Bottom 0.61: v86.61,73.15 109.98,73.15 120.9,62.23 120.9,32.38 119.63,31.11 112.01,31.11 110.74,32.38 LCD_BACK.4
GPIO23
  Bottom 0.406: SV1.16 CLKOUT1.A
GPIO24  (via drill 1.1 pad 1.93)
  Top 0.61: v173.61,89.53 v133.6,89.53 | v95.5,78.11 v95.5,67.94
  Bottom 0.61: SG1.+ 174.24,88.9 v173.61,89.53 | v133.6,89.53 130.43,89.53 120.9,80.01 120.9,78.74 119.63,77.47 96.14,77.47 v95.5,78.11 | v95.5,67.94 95.5,64.77 94.23,63.5 84.07,63.5 79.63,67.94 75.31,67.94 SV1.18
GPIO26  (1 unrouted)
  Bottom 0.61: SV1.37 71.5,42.67 70.1,41.27 70.1,33.66 72.01,31.75 82.17,31.75 83.44,30.48 83.44,23.5 84.07,22.86 95.5,22.86 106.3,12.06 151.44,12.06 U$3.1 | R9.2 168.53,8.26 165.99,10.79 165.3,10.79 U$3.2
N$1  (via drill 1.1 pad 1.93)
  Top 0.406: v138.05,78.74 v138.05,70.48
  Bottom 0.406: R5.1 137.41,71.12 v138.05,70.48 | v138.05,78.74 138.05,77.22 | 138.05,77.22 SJ2.2 | 138.05,77.22 140.58,77.22 U1.15
N$2
  Bottom 0.61: U1.7 R3.2 | 147.92,70.99 C1.1
  Bottom 0.813: 147.92,70.99 R3.2
N$3
  Bottom 0.61: R4.2 146.31,66.8 U1.8 146.78,69.25 C1.2
N$4
  Bottom 0.406: U1.2 146.44,77.47 148.21,77.47 149.48,78.74 155.19,78.74 157.35,76.58 Q1.B
N$5  (via drill 1.1 pad 1.93)
  Top 0.61: v133.6,92.71 v159.64,92.71
  Bottom 0.61: D2.ANODE 32.64,71.12 31.37,72.39 31.37,90.81 37.08,96.52 129.79,96.52 v133.6,92.71 | v159.64,92.71 160.91,92.71 168.53,85.09 168.53,62.87 166.62,60.96 BAT1.1
N$6
  Bottom 0.61: R32.2 R31.1
N$7
  Bottom 0.406: U1.6 150.5,72.26 151.13,71.63 151.13,69.76 C2.2
N$8
  Bottom 0.61: D1.CATHODE 45.97,71.12 45.34,71.75 | 45.34,71.75 45.34,74.56 C4.2 45.7,75.3 47.24,76.83 RTC.8 | D2.CATHODE 44.7,71.12 45.34,71.75
N$9
  Bottom 0.61: CLKOUT.C RTC.7
N$10
  Bottom 0.61: R6.2 CLKOUT.A
N$11
  Bottom 0.406: RTC.1 38.99,76.83 Q2.1 35.45,76.2 C9.2
N$12
  Bottom 0.406: RTC.2 39,78.09 Q2.2
N$14
  Bottom 0.61: L1.2 40.13,26.54 40.89,27.3 47.88,27.3 48.51,26.67 48.51,23.88 U$6.P$3 48.69,21.41 49.78,20.32 61.85,20.32 D3.A
N$16
  Bottom 0.61: U$6.P$4 54.28,23.7 R13.2 R12.1
N$17
  Bottom 0.406: IC3.2 IC2.3 138.05,50.16 138.68,49.53 140.59,49.53 141.22,48.9 141.22,40.64 140.59,40.01 R41.2
N$18
  Bottom 0.61: R14.1 R16.2 | IC1.1 94.64,10.39 R16.2 | C14.+ R16.2
N$19
  Bottom 0.406: CLKOUT1.C 83.92,66.19 84.71,65.41 R15.2
N$20
  Bottom 0.406: R19.2 R32.1
  Bottom 0.61: R17.1 R32.1
N$21
  Bottom 0.406: R18.2 R41.1
N$22
  Bottom 0.406: IC3.3 136.78,57.78 137.41,58.42 143.13,58.42 143.76,57.78 IC4.2
N$23  (via drill 3.2 pad 1.93)
  other vias: 4.06,101.6
N$24  (via drill 3.2 pad 1.93)
  other vias: 184.4,101.6
N$25  (via drill 3.2 pad 1.93)
  other vias: 184.4,3.81
N$26  (via drill 3.2 pad 1.93)
  other vias: 4.06,3.81
P_VALUE
  Bottom 0.61: 138.68,92.9 J1.P$2
  Bottom 0.813: R21.1 138.68,92.9
P_VALUE_V2
  Bottom 0.61: R21.2 R22.1 R17.2 127.25,78.74
VFB1  (via drill 1.1 pad 1.93)
  Top 0.406: v150.11,74.68 v150.11,65.41
  Bottom 0.406: U1.4 149.99,74.8 v150.11,74.68 | JP3.2 148.84,64.14 v150.11,65.41
VFB2  (via drill 1.1 pad 1.93)
  Top 0.406: v157.1,63.5 v153.29,63.5
  Bottom 0.406: R1.1 157.61,82.3 R2.2 164.59,82.68 165.99,81.28 165.99,64.77 164.72,63.5 v157.1,63.5 | JP3.3 152.02,62.23 v153.29,63.5
(copper drawn outside any net)
  shapes: Bottom area x2

### Text on the board
Bottom: Raspberry Pi / Photometer